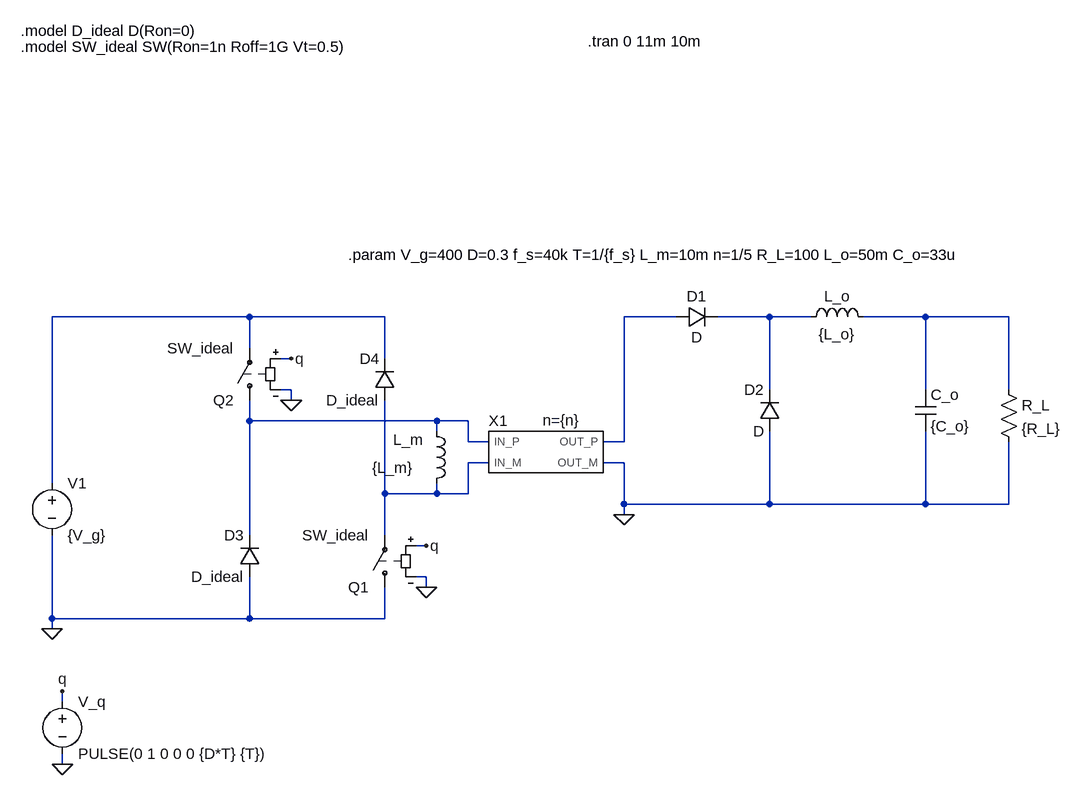
[diagram p0: schematic DC_DC.asc]
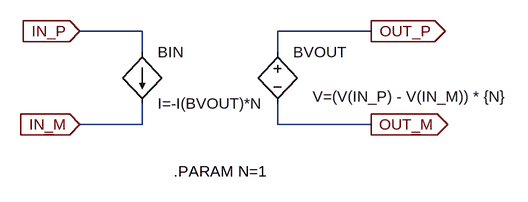
[diagram p1: sub-circuit transformer.asc]
DC_DC.asc, the LTspice schematic file:
Version 4
SHEET 1 1424 868
WIRE 112 160 -192 160
WIRE 320 160 112 160
WIRE 768 160 688 160
WIRE 912 160 832 160
WIRE 976 160 912 160
WIRE 1152 160 1056 160
WIRE 1280 160 1152 160
WIRE 112 208 112 160
WIRE 176 224 160 224
WIRE 320 224 320 160
WIRE 176 272 160 272
WIRE 912 272 912 160
WIRE 1152 272 1152 160
WIRE 1280 272 1280 160
WIRE 176 288 176 272
WIRE 112 320 112 288
WIRE 400 320 112 320
WIRE 448 320 400 320
WIRE 400 336 400 320
WIRE 448 352 448 320
WIRE 480 352 448 352
WIRE 688 352 688 160
WIRE 688 352 656 352
WIRE 480 384 448 384
WIRE 688 384 656 384
WIRE -192 416 -192 160
WIRE 320 432 320 288
WIRE 400 432 400 416
WIRE 400 432 320 432
WIRE 448 432 448 384
WIRE 448 432 400 432
WIRE 688 448 688 384
WIRE 912 448 912 336
WIRE 912 448 688 448
WIRE 1152 448 1152 336
WIRE 1152 448 912 448
WIRE 1280 448 1280 352
WIRE 1280 448 1152 448
WIRE 688 464 688 448
WIRE 112 496 112 320
WIRE 320 496 320 432
WIRE 384 512 368 512
WIRE 384 560 368 560
WIRE 384 576 384 560
WIRE -192 624 -192 496
WIRE 112 624 112 560
WIRE 112 624 -192 624
WIRE 320 624 320 576
WIRE 320 624 112 624
WIRE -192 640 -192 624
WIRE -176 752 -176 736
WIRE -176 848 -176 832
FLAG 176 288 0
FLAG 384 576 0
FLAG 176 224 q
FLAG 384 512 q
FLAG -176 736 q
FLAG -176 848 0
FLAG -192 640 0
FLAG 688 464 0
SYMBOL voltage -192 400 R0
SYMATTR InstName V1
SYMATTR Value {V_g}
SYMBOL sw 112 304 R180
SYMATTR InstName Q2
SYMATTR Value SW_ideal
SYMBOL sw 320 592 R180
SYMATTR InstName Q1
SYMATTR Value SW_ideal
SYMBOL diode 128 560 R180
WINDOW 0 24 64 Left 2
WINDOW 3 24 0 Left 2
SYMATTR InstName D3
SYMATTR Value D_ideal
SYMBOL diode 336 288 R180
WINDOW 0 24 64 Left 2
WINDOW 3 24 0 Left 2
SYMATTR InstName D4
SYMATTR Value D_ideal
SYMBOL transformer 560 368 R0
WINDOW 39 3 -49 Left 2
SYMATTR SpiceLine n={n}
SYMATTR InstName X1
SYMBOL voltage -176 736 R0
WINDOW 123 0 0 Left 0
WINDOW 39 0 0 Left 0
SYMATTR InstName V_q
SYMATTR Value PULSE(0 1 0 0 0 {D*T} {T})
SYMBOL diode 768 176 R270
WINDOW 0 32 32 VTop 2
WINDOW 3 0 32 VBottom 2
SYMATTR InstName D1
SYMBOL diode 928 336 R180
WINDOW 0 24 64 Left 2
WINDOW 3 24 0 Left 2
SYMATTR InstName D2
SYMBOL ind 960 176 R270
WINDOW 0 32 56 VTop 2
WINDOW 3 5 56 VBottom 2
SYMATTR InstName L_o
SYMATTR Value {L_o}
SYMBOL ind 384 320 R0
WINDOW 0 -51 29 Left 2
WINDOW 3 -83 72 Left 2
SYMATTR InstName L_m
SYMATTR Value {L_m}
SYMBOL res 1264 256 R0
SYMATTR InstName R_L
SYMATTR Value {R_L}
SYMBOL cap 1136 272 R0
SYMATTR InstName C_o
SYMATTR Value {C_o}
TEXT 264 64 Left 2 !.param V_g=400 D=0.3 f_s=40k T=1/{f_s} L_m=10m n=1/5 R_L=100 L_o=50m C_o=33u
TEXT -240 -280 Left 2 !.model D_ideal D(Ron=0)
TEXT -240 -256 Left 2 !.model SW_ideal SW(Ron=1n Roff=1G Vt=0.5)
TEXT 632 -264 Left 2 !.tran 0 11m 10m

transformer.asc, the sub-circuit schematic file:
Version 4
SHEET 1 1128 680
WIRE -32 208 -128 208
WIRE 320 208 176 208
WIRE -32 240 -32 208
WIRE 176 240 176 208
WIRE -32 352 -32 320
WIRE -32 352 -128 352
WIRE 176 352 176 320
WIRE 320 352 176 352
FLAG -128 208 IN_P
IOPIN -128 208 In
FLAG -128 352 IN_M
IOPIN -128 352 In
FLAG 320 208 OUT_P
IOPIN 320 208 Out
FLAG 320 352 OUT_M
IOPIN 320 352 Out
SYMBOL bv 176 224 R0
WINDOW 3 54 85 Left 2
SYMATTR Value V=(V(IN_P) - V(IN_M)) * {N}
SYMATTR InstName BVOUT
SYMBOL bi -32 240 R0
SYMATTR InstName BIN
SYMATTR Value I=-I(BVOUT)*N
TEXT 16 424 Left 2 !.PARAM N=1

The netlist it stands for:
* DC_DC.asc
V1 N001 0 {V_g}
S§Q2 N005 N001 q 0 SW_ideal
S§Q1 0 N006 q 0 SW_ideal
D3 0 N005 D_ideal
D4 N006 N001 D_ideal
XX1 N005 N006 N002 0 transformer params: n={n}
V_q q 0 PULSE(0 1 0 0 0 {D*T} {T})
D1 N002 N003 D
D2 0 N003 D
L_o N003 N004 {L_o}
L_m N005 N006 {L_m}
R_L N004 0 {R_L}
C_o N004 0 {C_o}

* block symbol definitions
.subckt transformer IN_P IN_M OUT_P OUT_M
BVOUT OUT_P OUT_M V=(V(IN_P) - V(IN_M)) * {N}
BIN IN_P IN_M I=-I(BVOUT)*N
.PARAM N=1
.ends transformer

.model D D
.lib standard.dio
.param V_g=400 D=0.3 f_s=40k T=1/{f_s} L_m=10m n=1/5 R_L=100 L_o=50m C_o=33u
.model D_ideal D(Ron=0)
.model SW_ideal SW(Ron=1n Roff=1G Vt=0.5)
.tran 0 11m 10m
.backanno
.end